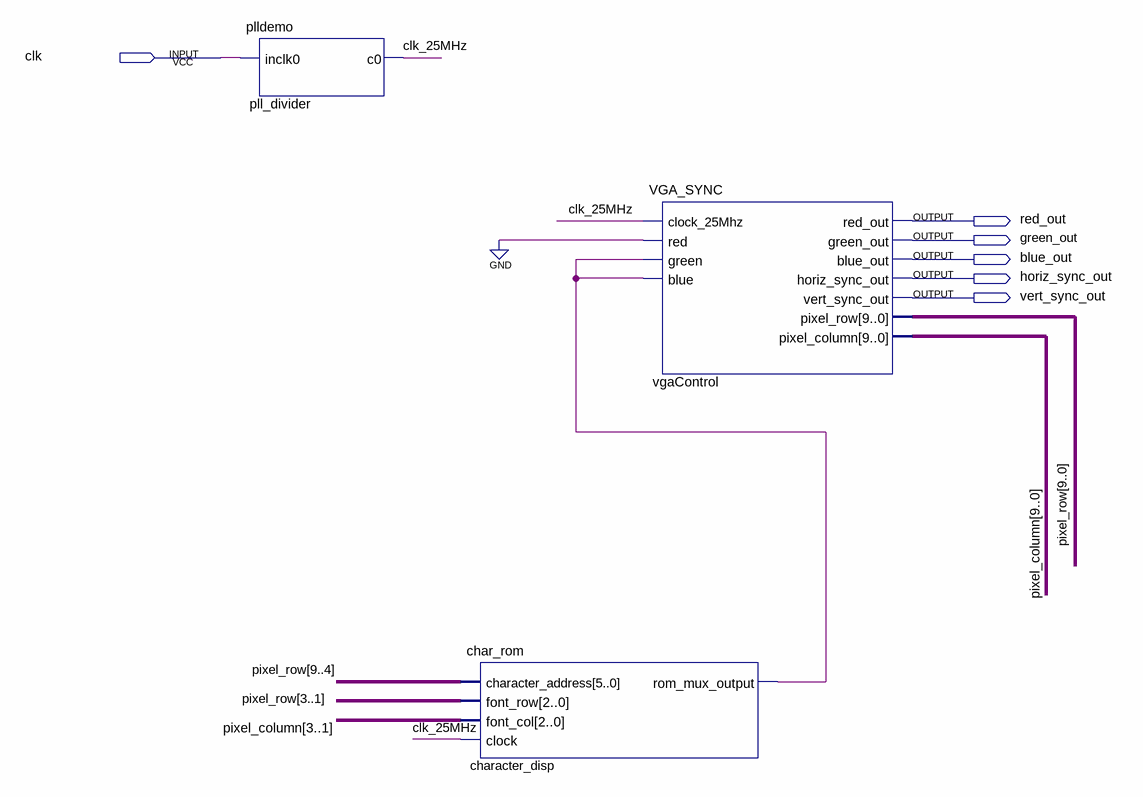
[diagram p0: schematic sheet]
// Quartus schematic VGAchecking.bdf as structural Verilog: 3 symbols, 6 pins
module VGAchecking (
  input  clk,
  output red_out,
  output green_out,
  output blue_out,
  output horiz_sync_out,
  output vert_sync_out
);

  wire character_disp_rom_mux_output, clk_25MHz;
  wire [9:0] pixel_column, pixel_row;

  plldemo pll_divider (.inclk0(clk), .c0(clk_25MHz));
  char_rom character_disp (
    .character_address(pixel_row[9:4]), .font_row(pixel_row[3:1]), .font_col(pixel_column[3:1]),
    .clock(clk_25MHz), .rom_mux_output(character_disp_rom_mux_output));
  VGA_SYNC vgaControl (
    .clock_25Mhz(clk_25MHz), .red(1'b0), .green(character_disp_rom_mux_output),
    .blue(character_disp_rom_mux_output), .red_out(red_out), .green_out(green_out), .blue_out(blue_out),
    .horiz_sync_out(horiz_sync_out), .vert_sync_out(vert_sync_out), .pixel_row(pixel_row),
    .pixel_column(pixel_column));
endmodule
